# Altium schematic sheet 05_Sensor_Keypad.SchDoc
size A4; Author: Ganghyeok Lim; Revision: B; SheetNumber: 6; SheetTotal: 7
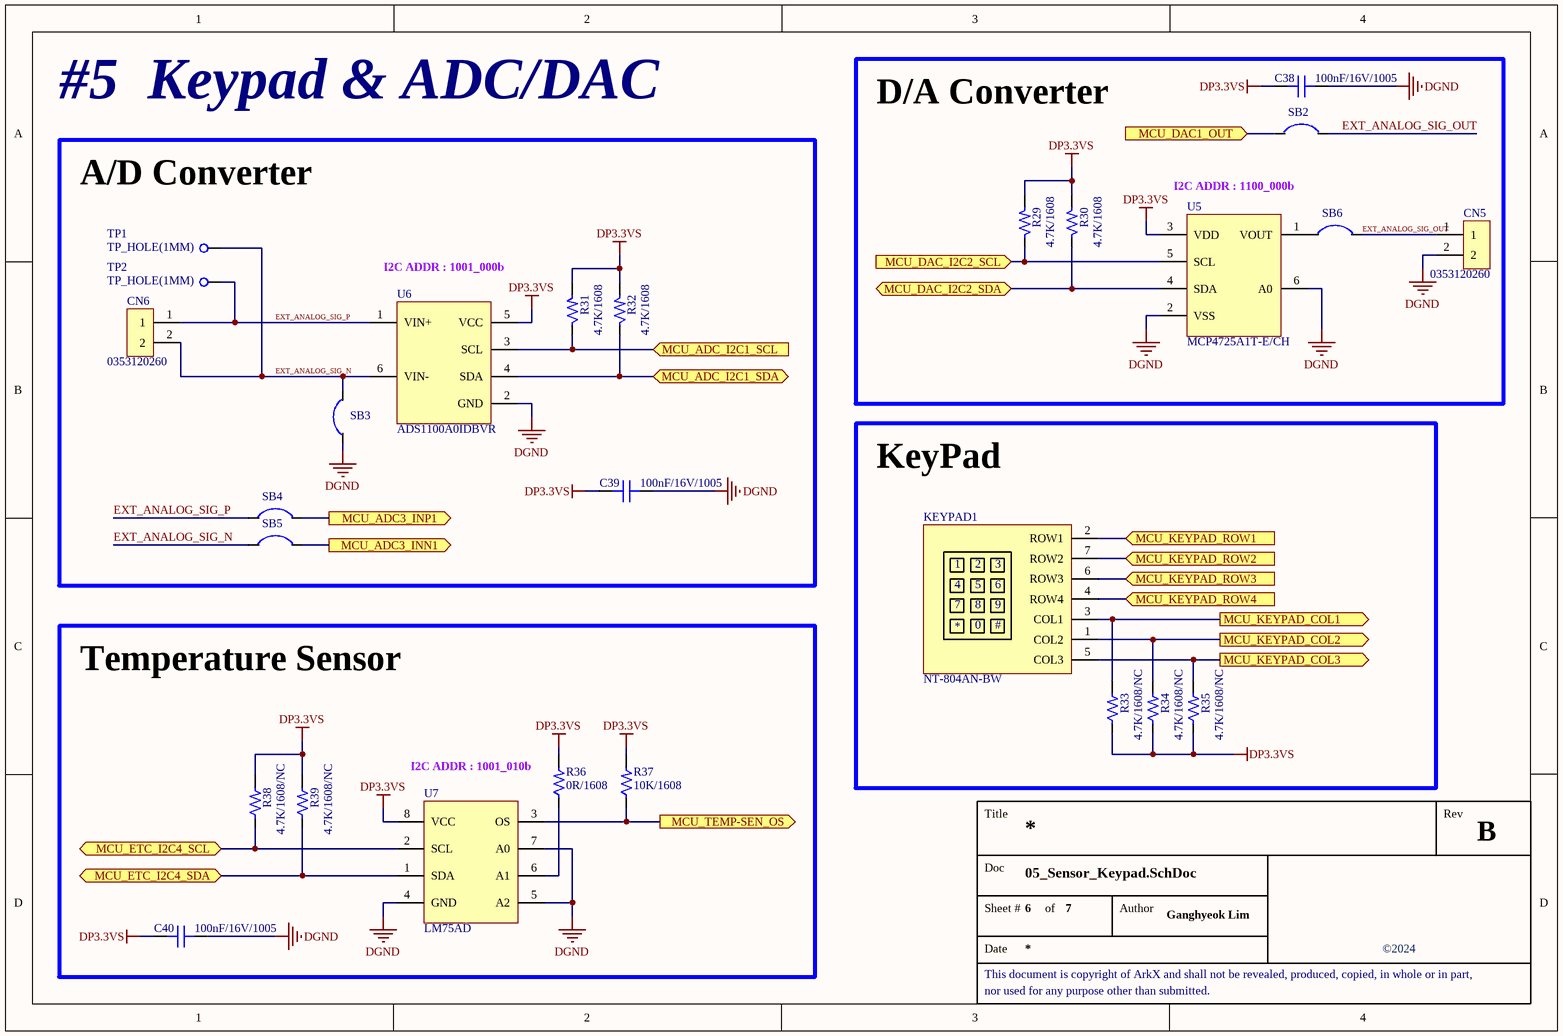
[diagram p0: 05_Sensor_Keypad.SchDoc]

## Parts
C38  100nF/16V/1005  [CAP 1005 (0402_INCH)]
C39  100nF/16V/1005  [CAP 1005 (0402_INCH)]
C40  100nF/16V/1005  [CAP 1005 (0402_INCH)]
CN5  0353120260  [CON 0353120260 (MOLEX)]
CN6  0353120260  [CON 0353120260 (MOLEX)]
KEYPAD1  NT-804AN-BW  [KEYPAD_NT-804AN-BW]
R29  4.7K/1608  [RES 1608 (0603_inch)]
R30  4.7K/1608  [RES 1608 (0603_inch)]
R31  4.7K/1608  [RES 1608 (0603_inch)]
R32  4.7K/1608  [RES 1608 (0603_inch)]
R33  4.7K/1608/NC  [RES 1608 (0603_inch)/NC]
R34  4.7K/1608/NC  [RES 1608 (0603_inch)/NC]
R35  4.7K/1608/NC  [RES 1608 (0603_inch)/NC]
R36  0R/1608  [RES 1608 (0603_inch)]
R37  10K/1608  [RES 1608 (0603_inch)]
R38  4.7K/1608/NC  [RES 1608 (0603_inch)/NC]
R39  4.7K/1608/NC  [RES 1608 (0603_inch)/NC]
SB2  SB  [SB (Solder-Bridge)]  (value not drawn)
SB3  SB  [SB (Solder-Bridge)]  (value not drawn)
SB4  SB  [SB (Solder-Bridge)]  (value not drawn)
SB5  SB  [SB (Solder-Bridge)]  (value not drawn)
SB6  SB  [SB (Solder-Bridge)]  (value not drawn)
TP1  TP_HOLE(1MM)  [TP_HOLE(1MM)]
TP2  TP_HOLE(1MM)  [TP_HOLE(1MM)]
U5  MCP4725A1T-E/CH  [SOT-23-6 (TI DBV PACKAGE)]
U6  ADS1100A0IDBVR  [SOT-23-6 (TI DBV PACKAGE)]
U7  LM75AD  [SOIC-8 150mil Wide (MICRO CHIP)]

## Blocks framed on the sheet
D/A Converter: C38 CN5 R29 R30 SB2 SB6 U5
A/D Converter: C39 CN6 R31 R32 SB3-SB5 TP1 TP2 U6
KeyPad: KEYPAD1 R33-R35
Temperature Sensor: C40 R36-R39 U7

## Ports
MCU_ADC3_INN1 (out), MCU_ADC3_INP1 (out), MCU_ADC_I2C1_SCL (in), MCU_ADC_I2C1_SDA (bidir), MCU_DAC1_OUT (in), MCU_DAC_I2C2_SCL (in), MCU_DAC_I2C2_SDA (bidir), MCU_ETC_I2C4_SCL (bidir), MCU_ETC_I2C4_SDA (bidir), MCU_KEYPAD_COL1 (out), MCU_KEYPAD_COL2 (out), MCU_KEYPAD_COL3 (out), MCU_KEYPAD_ROW1 (in), MCU_KEYPAD_ROW2 (in), MCU_KEYPAD_ROW3 (in), MCU_KEYPAD_ROW4 (in), MCU_TEMP-SEN_OS (out)

## Nets
DGND: C38.1 C39.1 C40.1 CN5.2 SB3.1 U5.2(VSS) U5.6(A0) U6.2(GND) U7.4(GND) U7.5(A2) U7.7(A0)
DP3.3VS: C38.2 C39.2 C40.2 R29.2 R30.2 R31.2 R32.2 R33.1 R34.1 R35.1 R36.2 R37.2 R38.2 R39.2 U5.3(VDD) U6.5(VCC) U7.8(VCC)
EXT_ANALOG_SIG_N: CN6.2 SB3.2 SB5.1 TP1.1(TP) U6.6(VIN-)
EXT_ANALOG_SIG_OUT: CN5.1 SB2.2 SB6.2
EXT_ANALOG_SIG_P: CN6.1 SB4.1 TP2.1(TP) U6.1(VIN+)
MCU_ADC3_INN1: SB5.2 ; port MCU_ADC3_INN1
MCU_ADC3_INP1: SB4.2 ; port MCU_ADC3_INP1
MCU_ADC_I2C1_SCL: R31.1 U6.3(SCL) ; port MCU_ADC_I2C1_SCL
MCU_ADC_I2C1_SDA: R32.1 U6.4(SDA) ; port MCU_ADC_I2C1_SDA
MCU_DAC1_OUT: SB2.1 ; port MCU_DAC1_OUT
MCU_DAC_I2C2_SCL: R29.1 U5.5(SCL) ; port MCU_DAC_I2C2_SCL
MCU_DAC_I2C2_SDA: R30.1 U5.4(SDA) ; port MCU_DAC_I2C2_SDA
MCU_ETC_I2C4_SCL: R38.1 U7.2(SCL) ; port MCU_ETC_I2C4_SCL
MCU_ETC_I2C4_SDA: R39.1 U7.1(SDA) ; port MCU_ETC_I2C4_SDA
MCU_KEYPAD_COL1: KEYPAD1.3(COL1) R33.2 ; port MCU_KEYPAD_COL1
MCU_KEYPAD_COL2: KEYPAD1.1(COL2) R34.2 ; port MCU_KEYPAD_COL2
MCU_KEYPAD_COL3: KEYPAD1.5(COL3) R35.2 ; port MCU_KEYPAD_COL3
MCU_KEYPAD_ROW1: KEYPAD1.2(ROW1) ; port MCU_KEYPAD_ROW1
MCU_KEYPAD_ROW2: KEYPAD1.7(ROW2) ; port MCU_KEYPAD_ROW2
MCU_KEYPAD_ROW3: KEYPAD1.6(ROW3) ; port MCU_KEYPAD_ROW3
MCU_KEYPAD_ROW4: KEYPAD1.4(ROW4) ; port MCU_KEYPAD_ROW4
MCU_TEMP-SEN_OS: R37.1 U7.3(OS) ; port MCU_TEMP-SEN_OS
NetR36_1: R36.1 U7.6(A1)
NetSB6_1: SB6.1 U5.1(VOUT)

## Notes on the sheet
- #5  Keypad & ADC/DAC
- I2C ADDR : 1100_000b
- I2C ADDR : 1001_000b
- (near R36) I2C ADDR : 1001_010b
- Title
- Rev
- Doc
- Sheet #
- of
- Author
- This document is copyright of ArkX and shall not be revealed, produced, copied, in whole or in part,
- Date
- ©2024
- nor used for any purpose other than submitted.
- (in symbol KEYPAD_NT-804AN-BW) 8; 9; 0; #

## Library data of the parts
C38-C40 = CAP_100nF/16V/1005: Ceramic CAP_100nF/16V/1005; LCSC Part #: C1525; JLCPCB Part Type: Basic Part
CN5 CN6 = CON_0353120260: CONN HEADER VERT 2POS 2.5MM
KEYPAD1 = KEYPAD_NT-804AN-BW: Legend(Character) type : Alpha-Numeric, Body/Key color : WHITE, Character color : BLACK
R29-R32 = RES_4.7K/1608/0.1W: Value: 4.7K; Power Rating: 0.1W; Precision: 1%; Size: 1608; LCSC Part #: C23162; JLCPCB Part Type: Basic Part
R33-R35 R38 R39 = RES_NC_4.7K/1608/0.1W: RES_4.7K/1608/0.1W; Value: 4.7K; Power Rating: 0.1W; Precision: 1%; Size: 1608
R36 = RES_0R/1608/0.1W: Value: 0R; Power Rating: 0.1W; Precision: 1%; Size: 1608; LCSC Part #: C21189; JLCPCB Part Type: Basic Part
R37 = RES_10K/1608/0.1W: Value: 10K; Power Rating: 0.1W; Precision: 1%; Size: 1608; LCSC Part #: C25804; JLCPCB Part Type: Basic Part
SB2-SB6 = SB_Solder-Bridge
U5 = IC_DAC_MCP4725A1T-E/CH: IC DAC 12BIT V-OUT SOT23-6; LCSC Part #: C61423; JLCPCB Part Type: Extended Part
U6 = IC_ADC_ADS1100A0IDBVR: IC ADC 16BIT SIGMA-DELTA SOT23-6; LCSC Part #: C23361; JLCPCB Part Type: Extended Part
U7 = IC_TEMP-SEN_LM75AD: Board Mount Temperature Sensors TEMP SENSOR DIGITAL; LCSC Part #: C7963; JLCPCB Part Type: Extended Part